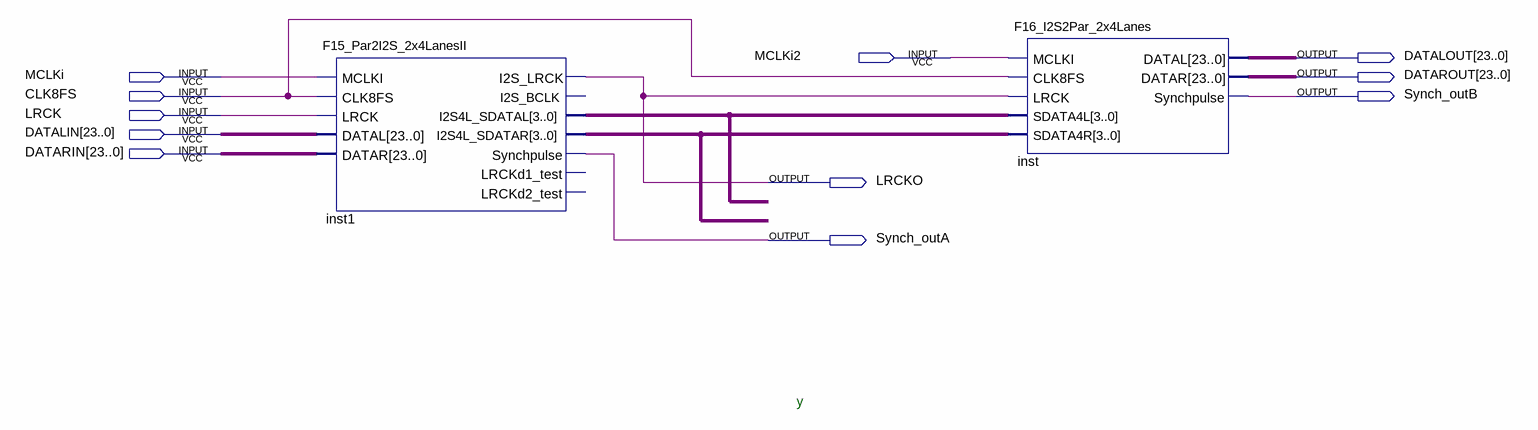
[diagram p0: schematic sheet]
// Quartus schematic 4LanesRXTX.bdf as structural Verilog: 2 symbols, 11 pins
module \4LanesRXTX  (
  input  MCLKi2,
  input  MCLKi,
  input  CLK8FS,
  input  LRCK,
  input  [23:0] DATALIN,
  input  [23:0] DATARIN,
  output [23:0] DATALOUT,
  output [23:0] DATAROUT,
  output Synch_outB,
  output LRCKO,
  output Synch_outA
);

  wire [3:0] inst1_i2s4l_sdatal, inst1_i2s4l_sdatar;

  F15_Par2I2S_2x4LanesII inst1 (
    .MCLKI(MCLKi), .CLK8FS(CLK8FS), .LRCK(LRCK), .DATAL(DATALIN), .DATAR(DATARIN), .I2S_LRCK(LRCKO),
    .I2S4L_SDATAL(inst1_i2s4l_sdatal), .I2S4L_SDATAR(inst1_i2s4l_sdatar), .Synchpulse(Synch_outA));  // open: I2S_BCLK, LRCKd1_test, LRCKd2_test
  F16_I2S2Par_2x4Lanes inst (
    .MCLKI(MCLKi2), .CLK8FS(CLK8FS), .LRCK(LRCKO), .SDATA4L(inst1_i2s4l_sdatal),
    .SDATA4R(inst1_i2s4l_sdatar), .DATAL(DATALOUT), .DATAR(DATAROUT), .Synchpulse(Synch_outB));

  // Notes on the sheet:
  //   y
endmodule
